# Altium schematic sheet 电子脚铐手持式主控板_RS485.SchDoc
size A4
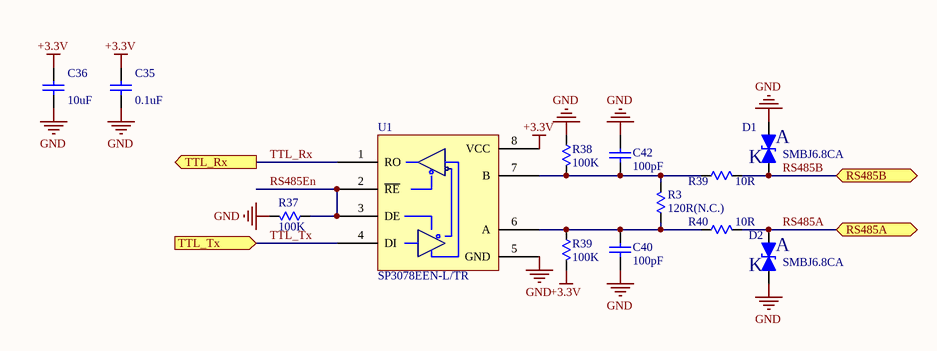
[diagram p0: 电子脚铐手持式主控板_RS485.SchDoc]

## Parts
(Parts that share a designator on the sheet are numbered #1, #2 ... from top to bottom, then left to right.)
C35  0.1uF  [C0603]
C36  10uF  [C0603]
C40  100pF  [C0603]
C42  100pF  [C0603]
D1  SMBJ6.8CA  [SMB]
D2  SMBJ6.8CA  [SMB]
R3  120R(N.C.)  [R0805]
R37  100K  [R0603]
R38  100K  [R0603]
R39#1  10R  [R0603]
R39#2  100K  [R0603]
R40  10R  [R0603]
U1  SP3078EEN-L/TR  [SO-8]

## Ports
RS485A (bidir), RS485B (bidir), TTL_Rx (out), TTL_Tx (in)

## Nets
+3.3V: C35.1 C36.1 R39#2.2 U1.8(VCC)
GND: C35.2 C36.2 C40.2 C42.1 D1.1(A) D2.2(K) R37.2 R38.1 U1.5(GND)
RS485A: D2.1(A) R40.2 ; port RS485A
RS485B: D1.2(K) R39#1.2 ; port RS485B
RS485En: R37.1 U1.2(~{RE}) U1.3(DE)
TTL_Rx: U1.1(RO) ; port TTL_Rx
TTL_Tx: U1.4(DI) ; port TTL_Tx
NetC40_1: C40.1 R3.1 R39#2.1 R40.1 U1.6(A)
NetC42_2: C42.2 R3.2 R38.2 R39#1.1 U1.7(B)

## Notes on the sheet
- 文件名:
- 审核:
- 制图人:
- 孟浩
- 校对:
- 图号:
- 批准:
- 日期:

## Library data of the parts
C35 C36 C40 C42 = CAP: Published: 8-Jun-2000; LatestRevisionDate: 17-Jul-2002; LatestRevisionNote: Re-released for DXP Platform.; PackageReference: RAD-0.3; Publisher: Altium Limited
D1 D2 = BS0300N
R3 R37 R38 R39#1 R39#2 R40 = RES: Resistor; Published: 8-Jun-2000; LatestRevisionDate: 17-Jul-2002; LatestRevisionNote: Re-released for DXP Platform.; PackageReference: AXIAL-0.3; Publisher: Altium Limited
  R3: Value: 120R(N.C.)
U1 = SP3078EEN